# Altium schematic sheet Hermes.SchDoc
size Letter; SheetNumber: 1; SheetTotal: 4
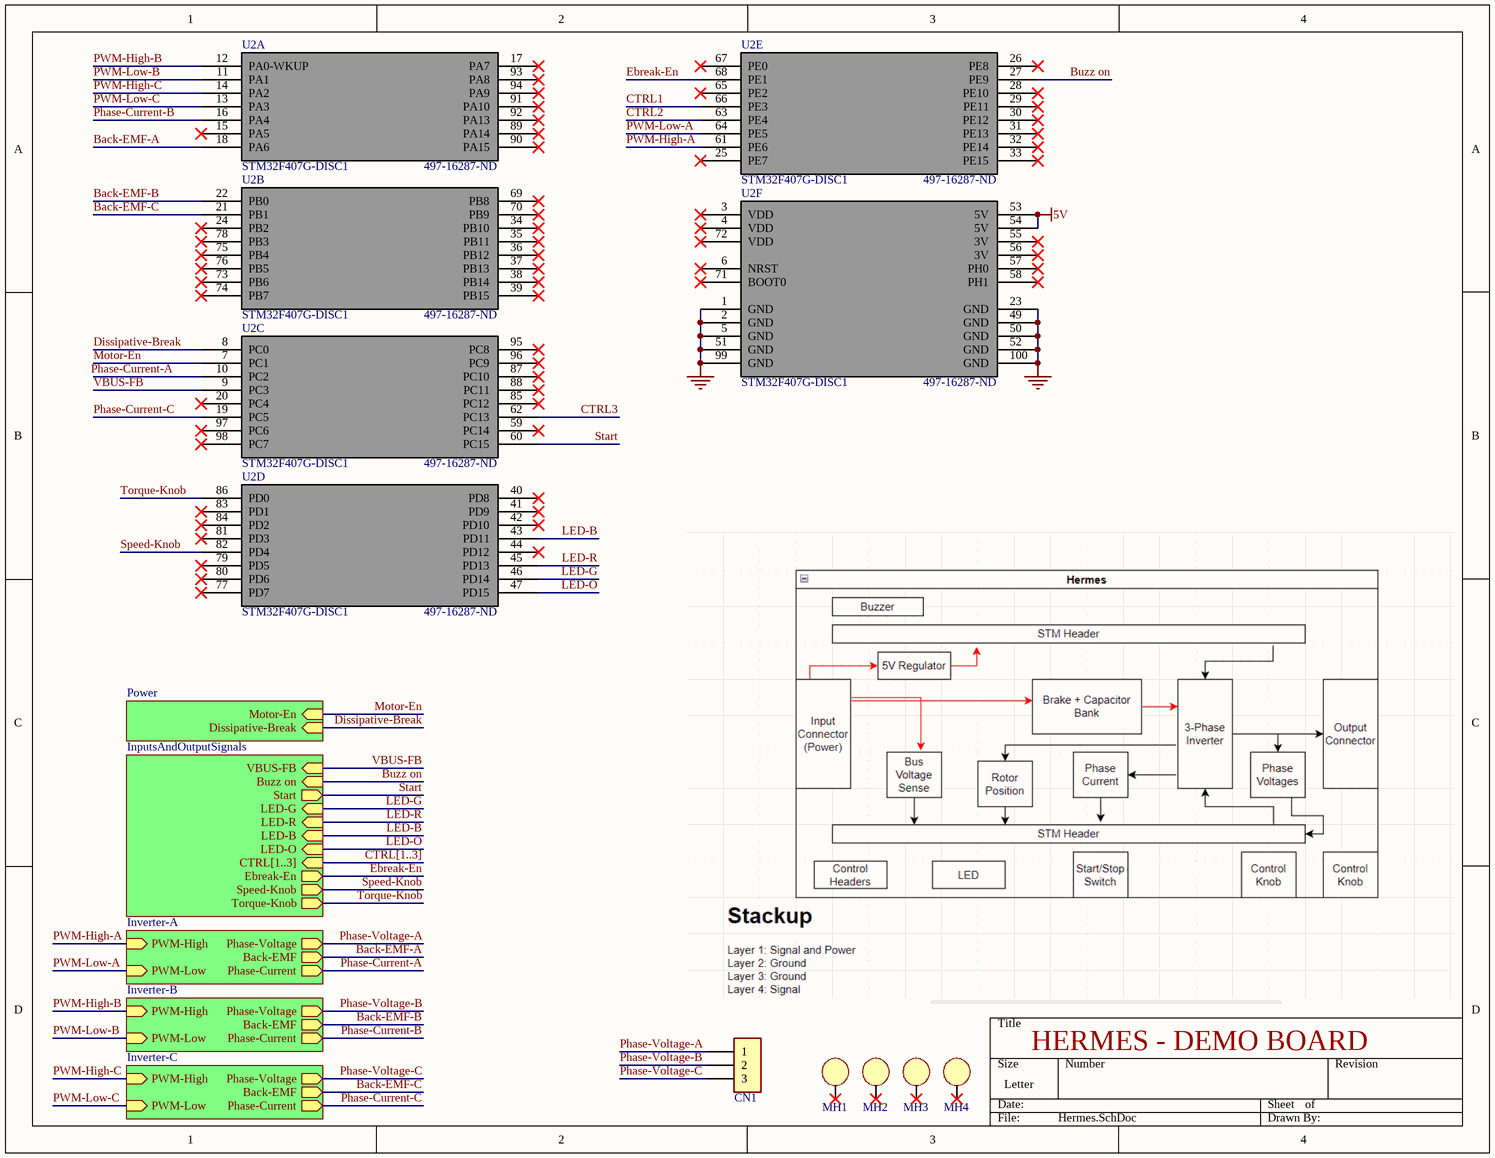
[diagram p0: Hermes.SchDoc]

## Parts
CN1  Conn, 3-Pin  [Conn, 3-Pin]  (value not drawn)
MH1  Mount_Hole_3mm  [Mount-Hole_3mm]  (value not drawn)  (no BOM)
MH2  Mount_Hole_3mm  [Mount-Hole_3mm]  (value not drawn)  (no BOM)
MH3  Mount_Hole_3mm  [Mount-Hole_3mm]  (value not drawn)  (no BOM)
MH4  Mount_Hole_3mm  [Mount-Hole_3mm]  (value not drawn)  (no BOM)
U2  STM32F407G-DISC1  Supplier Part Number 1: 497-16287-ND  [STM32F4]  (parts A,B,C,D,E,F of 6)

## Sub-sheets
InputsAndOutputSignals = Indicators and Control.SchDoc: Buzz on (in), Start (out), LED-G (in), LED-R (in), LED-B (in), LED-O (in), CTRL[1..3] (in), Ebreak-En (out), Speed-Knob (out), Torque-Knob (out), VBUS-FB (in)
Inverter-A = Inverter.SchDoc: Phase-Voltage (out), PWM-High (in), PWM-Low (in), Back-EMF (out), Phase-Current (out)
Inverter-B = Inverter.SchDoc: Phase-Voltage (out), PWM-High (in), PWM-Low (in), Back-EMF (out), Phase-Current (out)
Inverter-C = Inverter.SchDoc: Phase-Voltage (out), PWM-High (in), PWM-Low (in), Back-EMF (out), Phase-Current (out)
Power = Power.SchDoc: Motor-En (in), Dissipative-Break (in)

## Nets
5V: U2.53(5V) U2.54(5V)
GND: U2.1(GND) U2.2(GND) U2.5(GND) U2.23(GND) U2.49(GND) U2.50(GND) U2.51(GND) U2.52(GND) U2.99(GND) U2.100(GND)
Back-EMF-A: U2.18(PA6) ; sheet Inverter-A/Back-EMF
Back-EMF-B: U2.22(PB0) ; sheet Inverter-B/Back-EMF
Back-EMF-C: U2.21(PB1) ; sheet Inverter-C/Back-EMF
Buzz on: U2.27(PE9) ; sheet InputsAndOutputSignals/Buzz on
CTRL1: U2.66(PE3)
CTRL2: U2.63(PE4)
CTRL3: U2.62(PC13)
Dissipative-Break: U2.8(PC0) ; sheet Power/Dissipative-Break
Ebreak-En: U2.68(PE1) ; sheet InputsAndOutputSignals/Ebreak-En
LED-B: U2.43(PD11) ; sheet InputsAndOutputSignals/LED-B
LED-G: U2.46(PD14) ; sheet InputsAndOutputSignals/LED-G
LED-O: U2.47(PD15) ; sheet InputsAndOutputSignals/LED-O
LED-R: U2.45(PD13) ; sheet InputsAndOutputSignals/LED-R
Motor-En: U2.7(PC1) ; sheet Power/Motor-En
Phase-Current-A: U2.10(PC2) ; sheet Inverter-A/Phase-Current
Phase-Current-B: U2.16(PA4) ; sheet Inverter-B/Phase-Current
Phase-Current-C: U2.19(PC5) ; sheet Inverter-C/Phase-Current
Phase-Voltage-A: CN1.1 ; sheet Inverter-A/Phase-Voltage
Phase-Voltage-B: CN1.2 ; sheet Inverter-B/Phase-Voltage
Phase-Voltage-C: CN1.3 ; sheet Inverter-C/Phase-Voltage
PWM-High-A: U2.61(PE6) ; sheet Inverter-A/PWM-High
PWM-High-B: U2.12(PA0-WKUP) ; sheet Inverter-B/PWM-High
PWM-High-C: U2.14(PA2) ; sheet Inverter-C/PWM-High
PWM-Low-A: U2.64(PE5) ; sheet Inverter-A/PWM-Low
PWM-Low-B: U2.11(PA1) ; sheet Inverter-B/PWM-Low
PWM-Low-C: U2.13(PA3) ; sheet Inverter-C/PWM-Low
Speed-Knob: U2.82(PD4) ; sheet InputsAndOutputSignals/Speed-Knob
Start: U2.60(PC15) ; sheet InputsAndOutputSignals/Start
Torque-Knob: U2.86(PD0) ; sheet InputsAndOutputSignals/Torque-Knob
VBUS-FB: U2.9(PC3) ; sheet InputsAndOutputSignals/VBUS-FB

Not connected (* = marked no-connect by the designer): MH1 1*; MH2 1*; MH3 1*; MH4 1*; U2 3(VDD)* 4(VDD)* 6(NRST)* 15(PA5)* 17(PA7)* 20(PC4)* 24(PB2)* 25(PE7)* 26(PE8)* 28(PE10)* 29(PE11)* 30(PE12)* 31(PE13)* 32(PE14)* 33(PE15)* 34(PB10)* 35(PB11)* 36(PB12)* 37(PB13)* 38(PB14)* 39(PB15)* 40(PD8)* 41(PD9)* 42(PD10)* 44(PD12)* 55(3V)* 56(3V)* 57(PH0)* 58(PH1)* 59(PC14)* 65(PE2)* 67(PE0)* 69(PB8)* 70(PB9)* 71(BOOT0)* 72(VDD)* 73(PB6)* 74(PB7)* 75(PB4)* 76(PB5)* 77(PD7)* 78(PB3)* 79(PD5)* 80(PD6)* 81(PD3)* 83(PD1)* 84(PD2)* 85(PC12)* 87(PC10)* 88(PC11)* 89(PA14)* 90(PA15)* 91(PA10)* 92(PA13)* 93(PA8)* 94(PA9)* 95(PC8)* 96(PC9)* 97(PC6)* 98(PC7)*

## Buses and harness runs
bus CTRL[1..3] = sheet InputsAndOutputSignals/CTRL[1..3]

## Notes on the sheet
- HERMES - DEMO BOARD

## Library data of the parts
MH1-MH4 = CMP-004-0010-5: Mounting hold for M3 hex standoff; Design Item ID: Mount_Hole_3mm; Component Type: Standard; Source: AUVic_Schematic_Library_Connectors.SchLib; Pin Count: 1
CN1 = Conn, 3-Pin: Supplier 1: Digi-Key; Supplier Part Number 1: A98334-ND
U2 = STM32F407G-DISC1: Supplier 1: Digi-Key